# Altium schematic sheet [02]MCU.SchDoc
size B
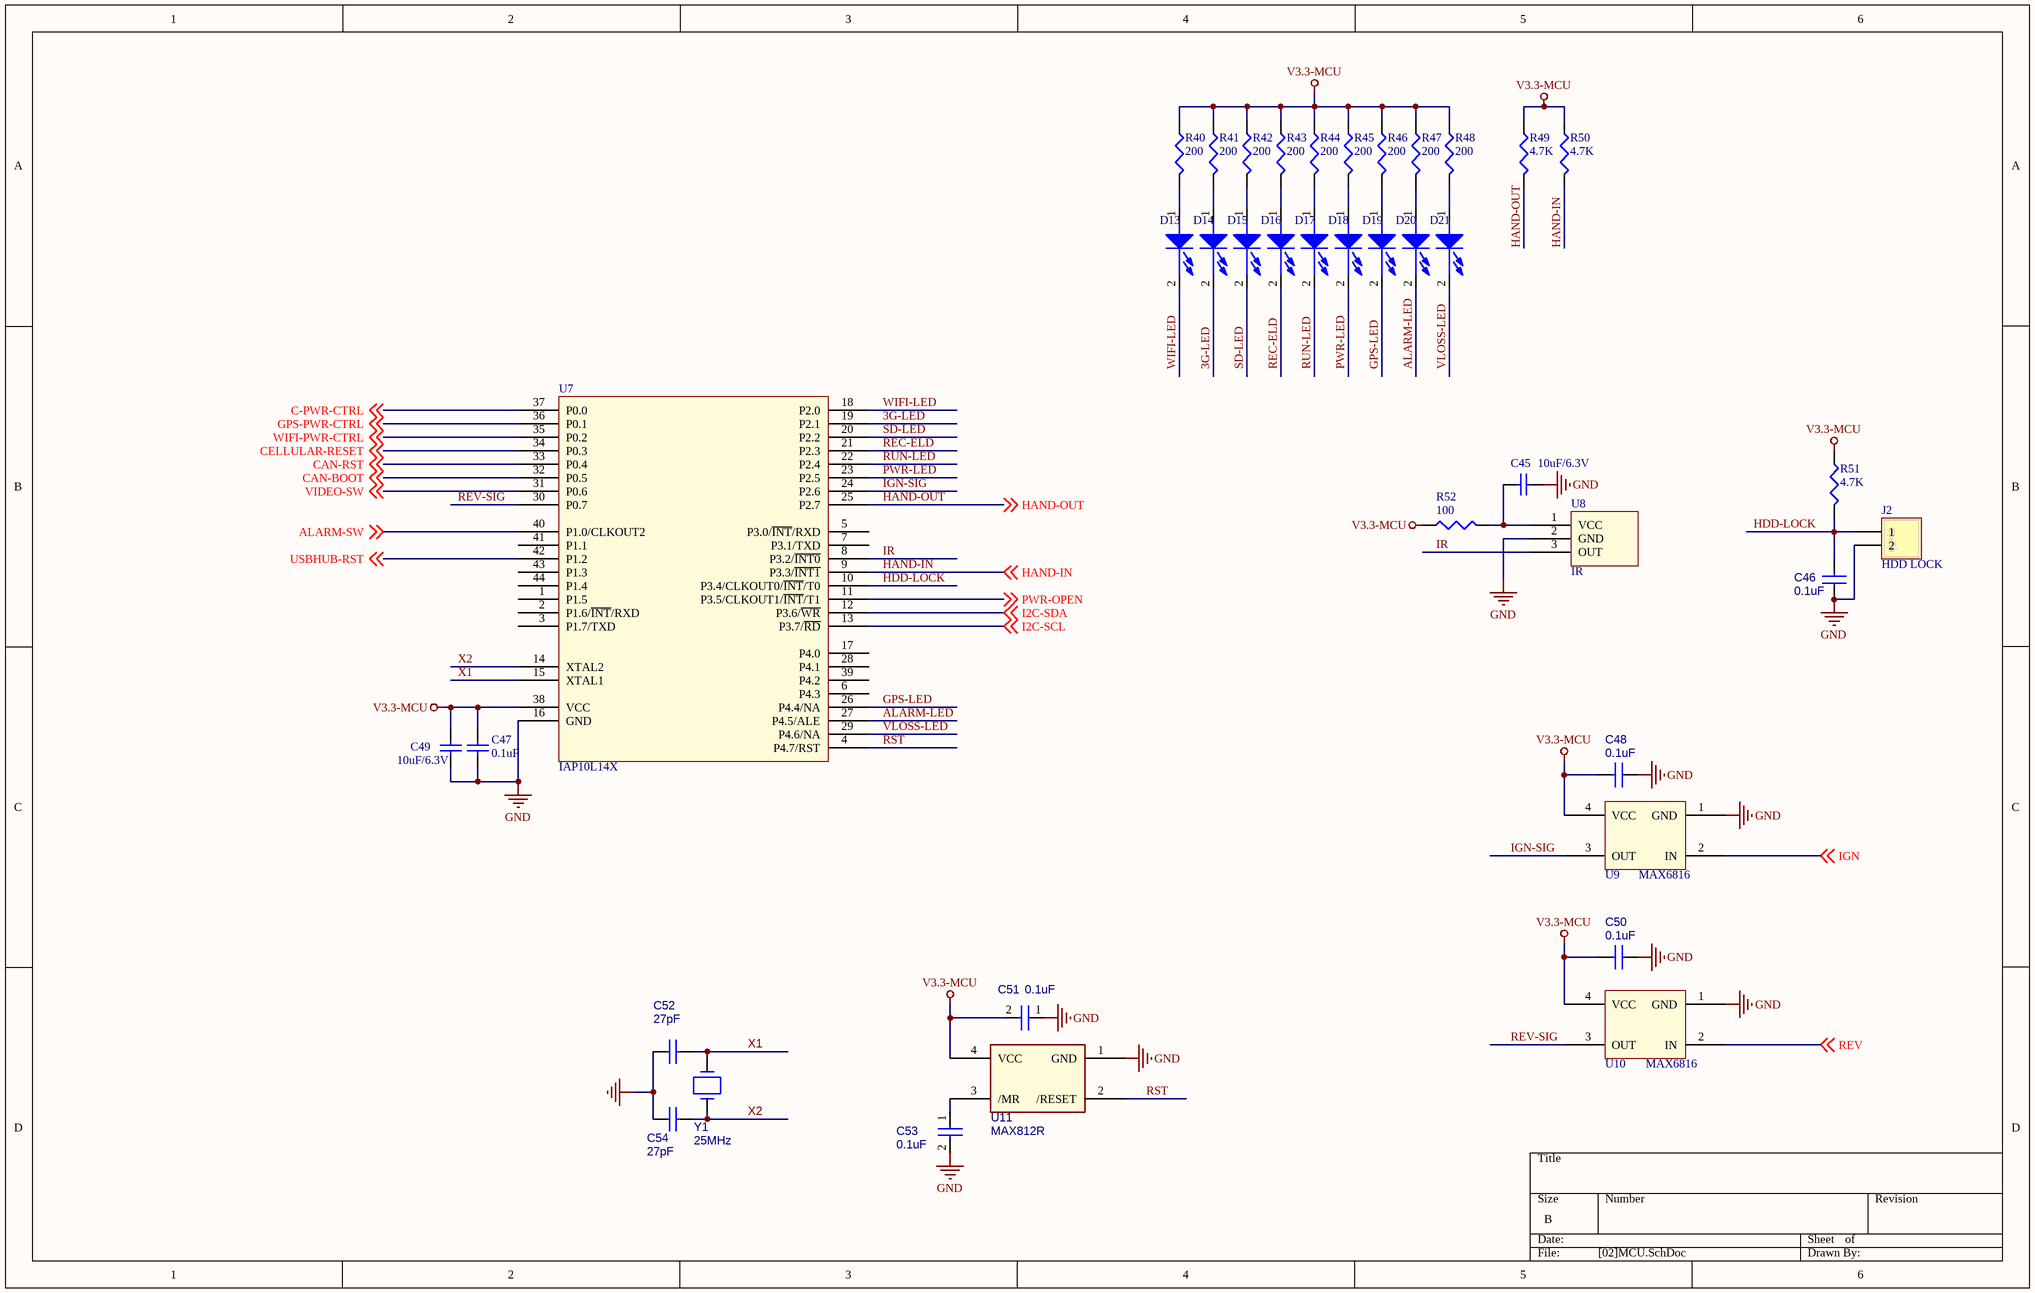
[diagram p0: [02]MCU.SchDoc]

## Parts
C45  10uF/6.3V  [0805]
C46  0.1uF  [0603]
C47  0.1uF  [0603]
C48  0.1uF  [0603]
C49  10uF/6.3V  [0805]
C50  0.1uF  [0603]
C51  0.1uF  [0603]
C52  27pF  [0603]
C53  0.1uF  [0603]
C54  27pF  [0603]
D13  LED GREEN  [LED-3MM]  (value not drawn)
D14  LED GREEN  [LED-3MM]  (value not drawn)
D15  LED GREEN  [LED-3MM]  (value not drawn)
D16  LED GREEN  [LED-3MM]  (value not drawn)
D17  LED GREEN  [LED-3MM]  (value not drawn)
D18  LED GREEN  [LED-3MM]  (value not drawn)
D19  LED GREEN  [LED-3MM]  (value not drawn)
D20  LED GREEN  [LED-3MM]  (value not drawn)
D21  LED GREEN  [LED-3MM]  (value not drawn)
J2  HDD LOCK  [CON-2PIN]
R40  200  [0603]
R41  200  [0603]
R42  200  [0603]
R43  200  [0603]
R44  200  [0603]
R45  200  [0603]
R46  200  [0603]
R47  200  [0603]
R48  200  [0603]
R49  4.7K  [0603]
R50  4.7K  [0603]
R51  4.7K  [0603]
R52  100  [0603]
U7  IAP10L14X  [LQFP44]
U8  IR  [IR]
U9  MAX6816  [SOT143]
U10  MAX6816  [SOT143]
U11  MAX812R  [SOT143]
Y1  25MHz  [XTAL_SMD]

## Nets
GND: C45.1 C46.1 C47.1 C48.1 C49.1 C50.1 C51.1 C52.1 C53.2 C54.1 J2.2 U7.16(GND) U8.2(GND) U9.1(GND) U10.1(GND) U11.1(GND)
V3.3-MCU: C47.2 C48.2 C49.2 C50.2 C51.2 R40.1 R41.1 R42.1 R43.1 R44.1 R45.1 R46.1 R47.1 R48.1 R49.1 R50.1 R51.1 R52.1 U7.38(VCC) U9.4(VCC) U10.4(VCC) U11.4(VCC)
3G-LED: D14.2(CATHODE) U7.19(P2.1)
ALARM-LED: D20.2(CATHODE) U7.27(P4.5/ALE)
ALARM-SW: U7.40(P1.0/CLKOUT2) ; off-sheet ALARM-SW
C-PWR-CTRL: U7.37(P0.0) ; off-sheet C-PWR-CTRL
CAN-BOOT: U7.32(P0.5) ; off-sheet CAN-BOOT
CAN-RST: U7.33(P0.4) ; off-sheet CAN-RST
CELLULAR-RESET: U7.34(P0.3) ; off-sheet CELLULAR-RESET
GPS-LED: D19.2(CATHODE) U7.26(P4.4/NA)
GPS-PWR-CTRL: U7.36(P0.1) ; off-sheet GPS-PWR-CTRL
HAND-IN: R50.2 U7.9(P3.3/~{INT1}) ; off-sheet HAND-IN
HAND-OUT: R49.2 U7.25(P2.7) ; off-sheet HAND-OUT
HDD-LOCK: C46.2 J2.1 R51.2 U7.10(P3.4/CLKOUT0/~{INT}/T0)
I2C-SCL: U7.13(P3.7/~{RD}) ; off-sheet I2C-SCL
I2C-SDA: U7.12(P3.6/~{WR}) ; off-sheet I2C-SDA
IGN: U9.2(IN) ; off-sheet IGN
IGN-SIG: U7.24(P2.6) U9.3(OUT)
IR: U7.8(P3.2/~{INT0}) U8.3(OUT)
PWR-LED: D18.2(CATHODE) U7.23(P2.5)
PWR-OPEN: U7.11(P3.5/CLKOUT1/~{INT}/T1) ; off-sheet PWR-OPEN
REC-ELD: D16.2(CATHODE) U7.21(P2.3)
REV: U10.2(IN) ; off-sheet REV
REV-SIG: U7.30(P0.7) U10.3(OUT)
RST: U7.4(P4.7/RST) U11.2(/RESET)
RUN-LED: D17.2(CATHODE) U7.22(P2.4)
SD-LED: D15.2(CATHODE) U7.20(P2.2)
USBHUB-RST: U7.42(P1.2) ; off-sheet USBHUB-RST
VIDEO-SW: U7.31(P0.6) ; off-sheet VIDEO-SW
VLOSS-LED: D21.2(CATHODE) U7.29(P4.6/NA)
WIFI-LED: D13.2(CATHODE) U7.18(P2.0)
WIFI-PWR-CTRL: U7.35(P0.2) ; off-sheet WIFI-PWR-CTRL
X1: C52.2 U7.15(XTAL1) Y1.2
X2: C54.2 U7.14(XTAL2) Y1.1
NetC45_2: C45.2 R52.2 U8.1(VCC)
NetC53_1: C53.1 U11.3(/MR)
NetD13_1: D13.1(ANODE) R40.2
NetD14_1: D14.1(ANODE) R41.2
NetD15_1: D15.1(ANODE) R42.2
NetD16_1: D16.1(ANODE) R43.2
NetD17_1: D17.1(ANODE) R44.2
NetD18_1: D18.1(ANODE) R45.2
NetD19_1: D19.1(ANODE) R46.2
NetD20_1: D20.1(ANODE) R47.2
NetD21_1: D21.1(ANODE) R48.2

Not connected (* = marked no-connect by the designer): U7 1(P1.5) 2(P1.6/~{INT}/RXD) 3(P1.7/TXD) 5(P3.0/~{INT}/RXD) 6(P4.3) 7(P3.1/TXD) 17(P4.0) 28(P4.1) 39(P4.2) 41(P1.1) 43(P1.3) 44(P1.4)

## Library data of the parts
C45 C47 C49 = Cap: Capacitor
C46 C48 C50 = CAP
C51 C53 = CAP NP_Dup2
C52 C54 = CAP_Dup1
D13-D21 = LN01401_1
J2 = Header 2: Header, 2-Pin; LatestRevisionDate: 17-Jul-2002; LatestRevisionNote: Re-released for DXP Platform.; Publisher: Altium Limited
R40-R52 = CR16-1003FM
U11 = MAX811
Y1 = CRYSTAL